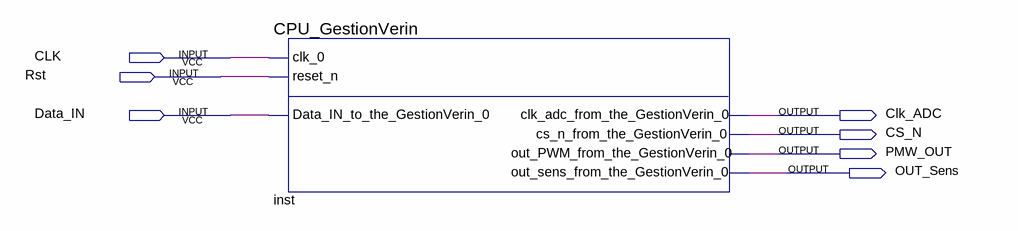
[diagram p0: schematic sheet]
// Quartus schematic Top.bdf as structural Verilog: 1 symbols, 7 pins
module Top (
  input  CLK,
  input  Rst,
  input  Data_IN,
  output Clk_ADC,
  output CS_N,
  output PMW_OUT,
  output OUT_Sens
);

  CPU_GestionVerin inst (
    .clk_0(CLK), .reset_n(Rst), .Data_IN_to_the_GestionVerin_0(Data_IN),
    .clk_adc_from_the_GestionVerin_0(Clk_ADC), .cs_n_from_the_GestionVerin_0(CS_N),
    .out_PWM_from_the_GestionVerin_0(PMW_OUT), .out_sens_from_the_GestionVerin_0(OUT_Sens));
endmodule
